# Altium schematic sheet 14_FEP.SchDoc
size A3
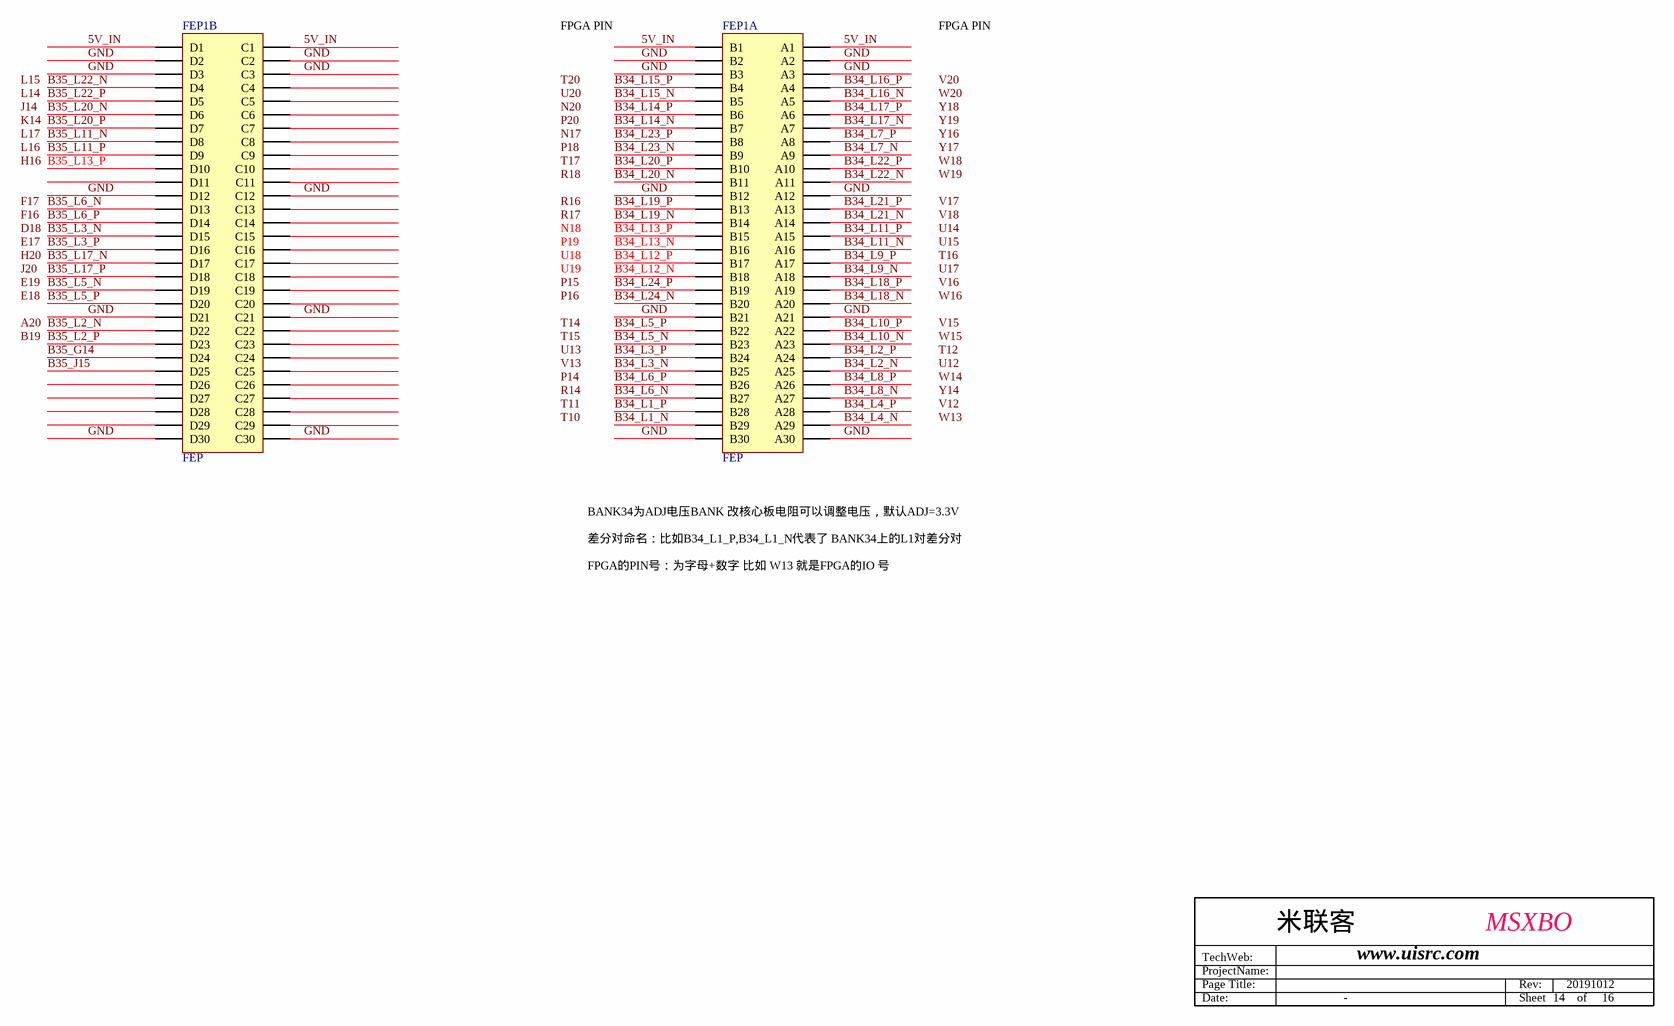
[diagram p0: 14_FEP.SchDoc]

## Parts
FEP1  FEP  [FEP-X2]  (parts A,B of 3)

## Nets
5V_IN: FEP1.A1 FEP1.B1 FEP1.C1 FEP1.D1
B34_L1_N: FEP1.B29
B34_L1_P: FEP1.B28
B34_L2_N: FEP1.A25
B34_L2_P: FEP1.A24
B34_L3_N: FEP1.B25
B34_L3_P: FEP1.B24
B34_L4_N: FEP1.A29
B34_L4_P: FEP1.A28
B34_L5_N: FEP1.B23
B34_L5_P: FEP1.B22
B34_L6_N: FEP1.B27
B34_L6_P: FEP1.B26
B34_L7_N: FEP1.A9
B34_L7_P: FEP1.A8
B34_L8_N: FEP1.A27
B34_L8_P: FEP1.A26
B34_L9_N: FEP1.A18
B34_L9_P: FEP1.A17
B34_L10_N: FEP1.A23
B34_L10_P: FEP1.A22
B34_L11_N: FEP1.A16
B34_L11_P: FEP1.A15
B34_L12_N: FEP1.B18
B34_L12_P: FEP1.B17
B34_L13_N: FEP1.B16
B34_L13_P: FEP1.B15
B34_L14_N: FEP1.B7
B34_L14_P: FEP1.B6
B34_L15_N: FEP1.B5
B34_L15_P: FEP1.B4
B34_L16_N: FEP1.A5
B34_L16_P: FEP1.A4
B34_L17_N: FEP1.A7
B34_L17_P: FEP1.A6
B34_L18_N: FEP1.A20
B34_L18_P: FEP1.A19
B34_L19_N: FEP1.B14
B34_L19_P: FEP1.B13
B34_L20_N: FEP1.B11
B34_L20_P: FEP1.B10
B34_L21_N: FEP1.A14
B34_L21_P: FEP1.A13
B34_L22_N: FEP1.A11
B34_L22_P: FEP1.A10
B34_L23_N: FEP1.B9
B34_L23_P: FEP1.B8
B34_L24_N: FEP1.B20
B34_L24_P: FEP1.B19
B35_G14: FEP1.D24
B35_J15: FEP1.D25
B35_L2_N: FEP1.D22
B35_L2_P: FEP1.D23
B35_L3_N: FEP1.D15
B35_L3_P: FEP1.D16
B35_L5_N: FEP1.D19
B35_L5_P: FEP1.D20
B35_L6_N: FEP1.D13
B35_L6_P: FEP1.D14
B35_L11_N: FEP1.D8
B35_L11_P: FEP1.D9
B35_L13_P: FEP1.D10
B35_L17_N: FEP1.D17
B35_L17_P: FEP1.D18
B35_L20_N: FEP1.D6
B35_L20_P: FEP1.D7
B35_L22_N: FEP1.D4
B35_L22_P: FEP1.D5
GND: FEP1.A2 FEP1.A3 FEP1.A12 FEP1.A21 FEP1.A30 FEP1.B2 FEP1.B3 FEP1.B12 FEP1.B21 FEP1.B30 FEP1.C2 FEP1.C3 FEP1.C12 FEP1.C21 FEP1.C30 FEP1.D2 FEP1.D3 FEP1.D12 FEP1.D21 FEP1.D30

Not connected (* = marked no-connect by the designer): FEP1 C4 C5 C6 C7 C8 C9 C10 C11 C13 C14 C15 C16 C17 C18 C19 C20 C22 C23 C24 C25 C26 C27 C28 C29 D11 D26 D27 D28 D29

## Notes on the sheet
- FPGA PIN
- BANK34为ADJ电压BANK 改核心板电阻可以调整电压，默认ADJ=3.3V
- 差分对命名：比如B34_L1_P,B34_L1_N代表了 BANK34上的L1对差分对
- FPGA的PIN号：为字母+数字 比如 W13 就是FPGA的IO 号
- ProjectName:
- TechWeb:
- Page Title:
- 米联客
- www.uisrc.com
- MSXBO
- Rev:
- 20191012
- Date:
- -
- Sheet
- 14    of     16
- Labels drawn without touching a wire or pin: A20, B19, D18, E17, E18, E19, F16, F17, H16, H20, J14, J20, K14, L14, L15, L16, L17, N17, N18, N20, P14, P15, P16, P18, P19, P20, R14, R16, R17, R18, T10, T11, T12, T14, T15, T16, T17, T20, U12, U13, U14, U15, U17, U18, U19, U20, V12, V13, V15, V16, V17, V18, V20, W13, W14, W15, W16, W18, W19, W20, Y14, Y16, Y17, Y18, Y19

## Library data of the parts
FEP1 = FEP-2X